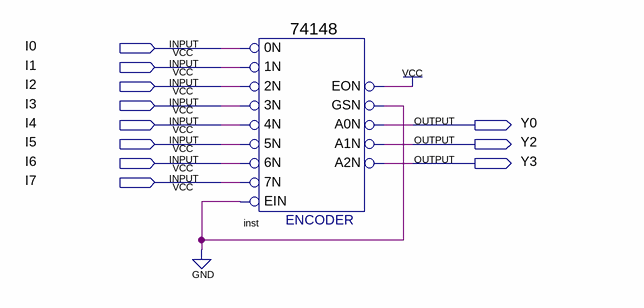
[diagram p0: schematic sheet]
// Quartus schematic eight_to_three_octal_encoder.bdf as structural Verilog: 1 symbols, 11 pins
module eight_to_three_octal_encoder (
  input  I0,
  input  I1,
  input  I2,
  input  I3,
  input  I4,
  input  I5,
  input  I6,
  input  I7,
  output Y0,
  output Y2,
  output Y3
);

  wire inst_eon, inst_gsn;

  \74148  inst (
    .\5N (I5), .\0N (I0), .\1N (I1), .\2N (I2), .\3N (I3), .\4N (I4), .EIN(inst_gsn), .\6N (I6), .\7N (I7),
    .A1N(Y2), .A0N(Y0), .A2N(Y3), .EON(inst_eon), .GSN(inst_gsn));
  // also tied to GND on the sheet: inst_gsn
  // also tied to VCC on the sheet: inst_eon
endmodule
